# Altium schematic sheet FPGA.SchDoc: Cart
size Tabloid; ApprovedBy: NA; CompanyName: Cospan Design LLC; DrawnBy: David McCoy; Engineer: David McCoy; DocumentNumber: 12; Revision: A; SheetNumber: 12; SheetTotal: 18; Client: OSH; Project: Guppy Buddy; ProjectPrettyName: Guppy Buddy
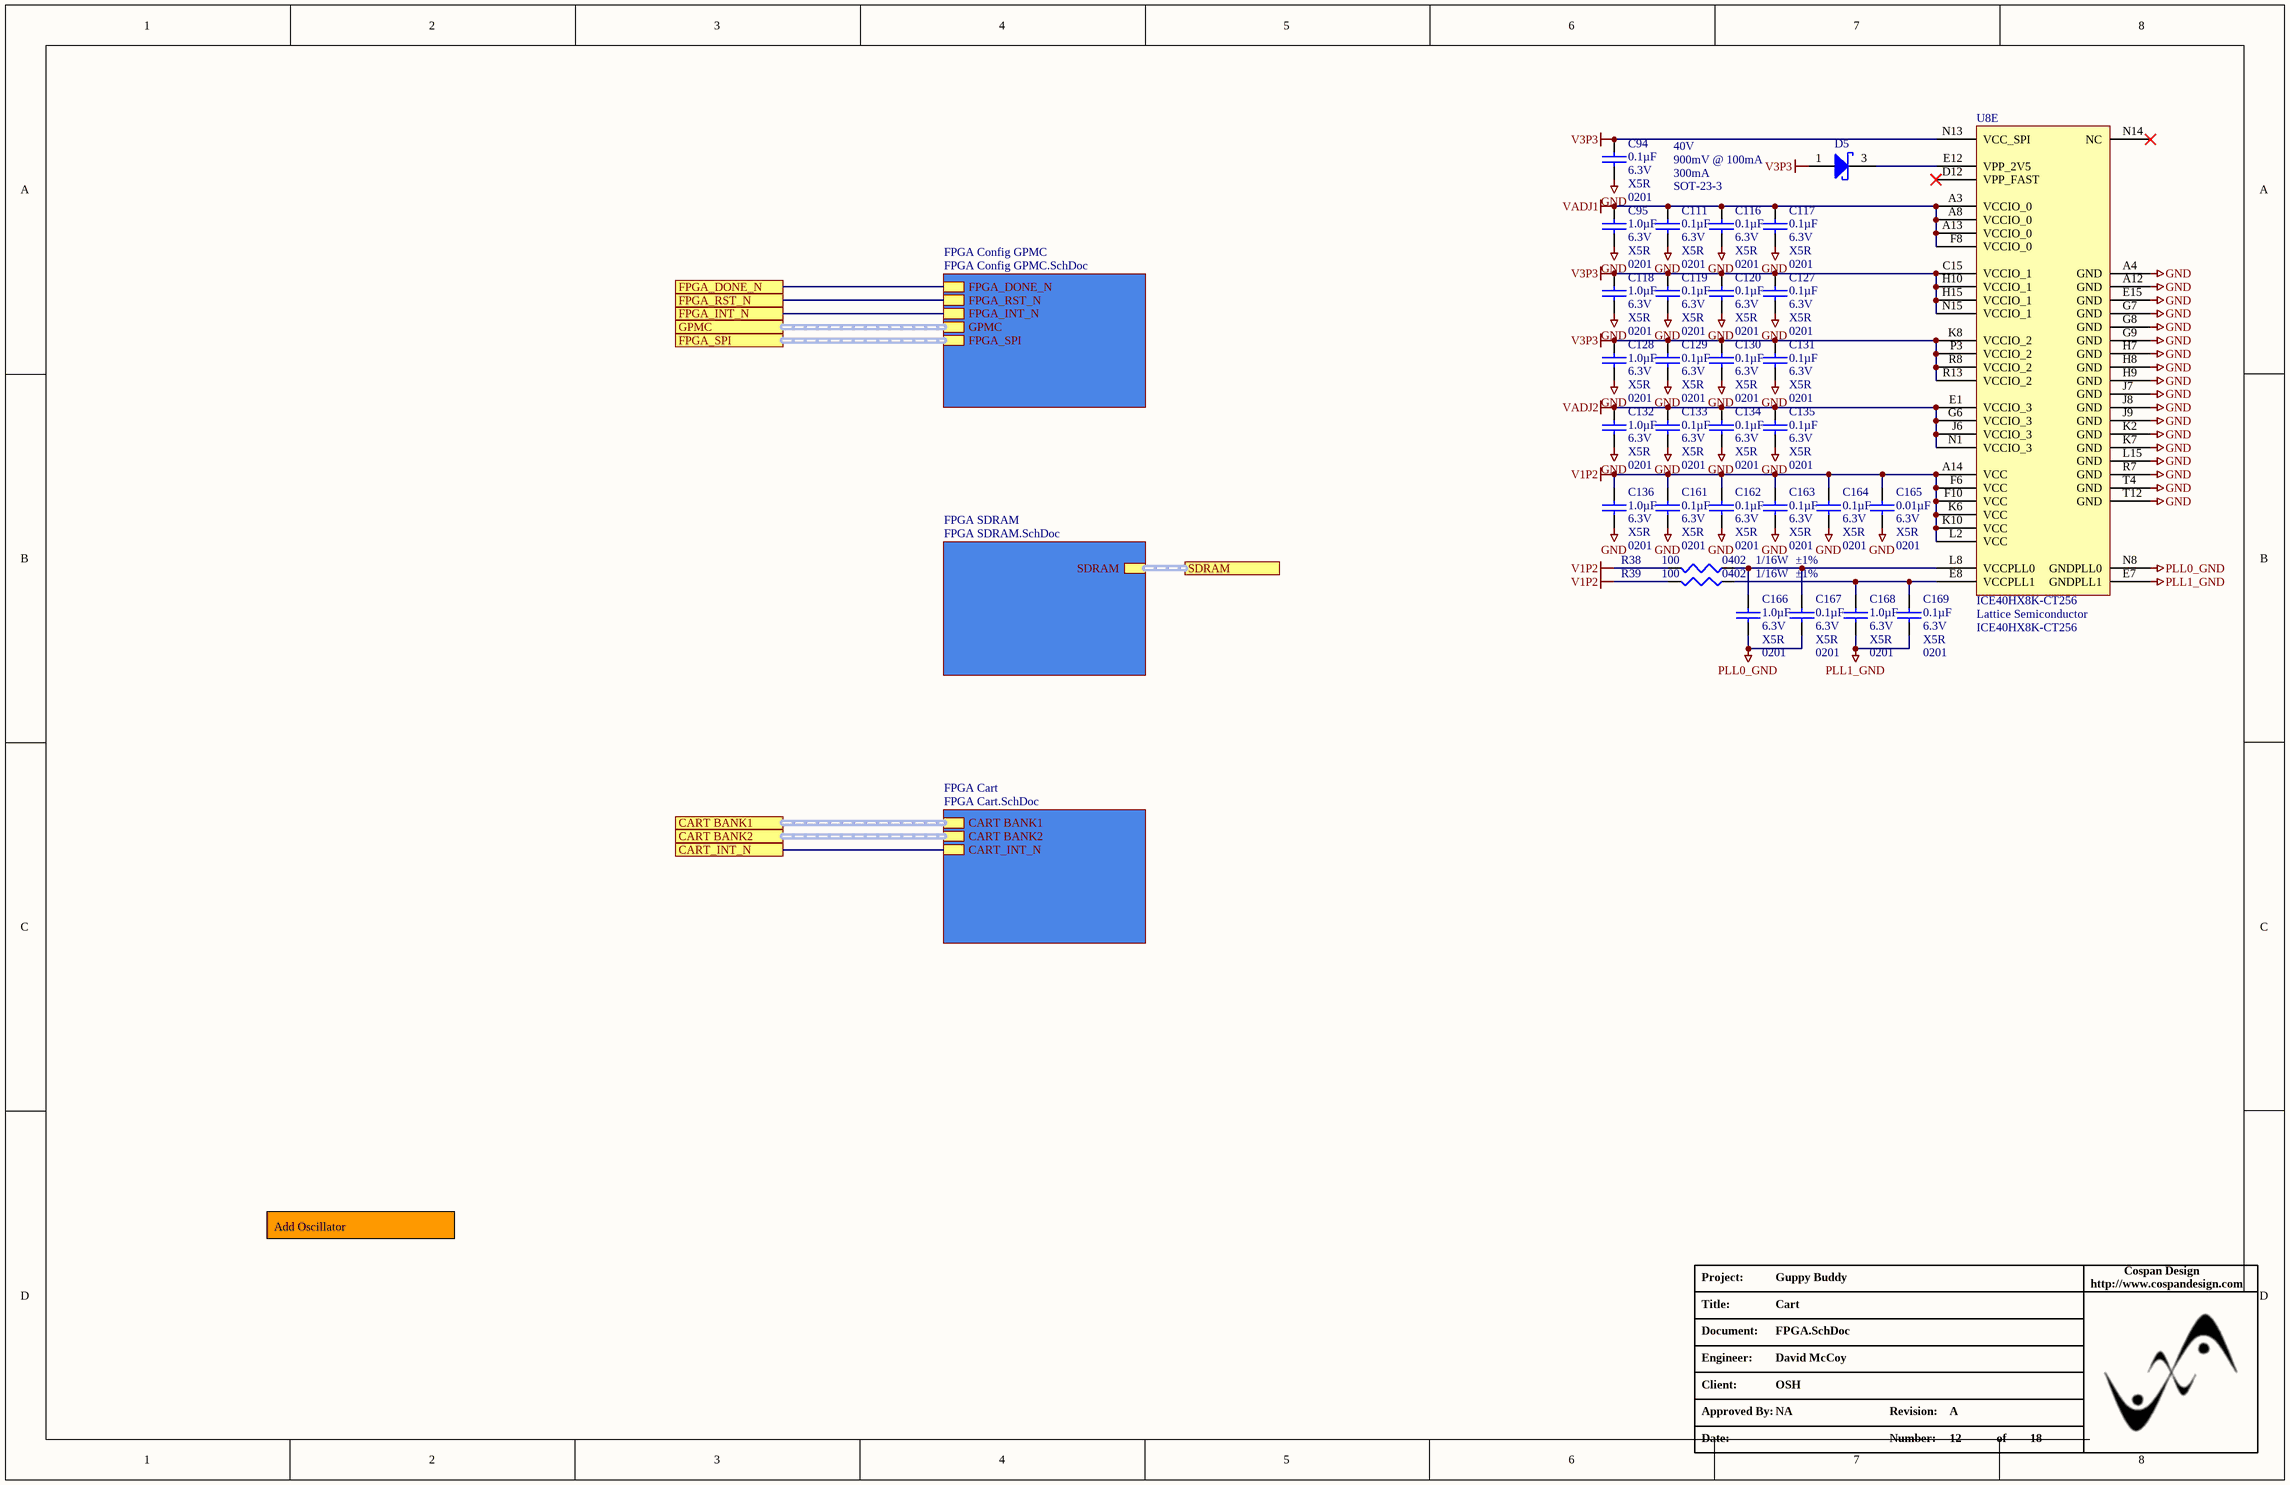
[diagram p0: FPGA.SchDoc]

## Parts
C94  Capacitance: 0.1µF  Voltage - Rated: 6.3V  Temperature Coefficient: X5R  Package / Case: 0201  [CAPC0201]  (hidden comment: 0.1UF)
C95  Capacitance: 1.0µF  Voltage - Rated: 6.3V  Temperature Coefficient: X5R  Package / Case: 0201  [CAPC0201]  (hidden comment: 1.0UF)
C111  Capacitance: 0.1µF  Voltage - Rated: 6.3V  Temperature Coefficient: X5R  Package / Case: 0201  [CAPC0201]  (hidden comment: 0.1UF)
C116  Capacitance: 0.1µF  Voltage - Rated: 6.3V  Temperature Coefficient: X5R  Package / Case: 0201  [CAPC0201]  (hidden comment: 0.1UF)
C117  Capacitance: 0.1µF  Voltage - Rated: 6.3V  Temperature Coefficient: X5R  Package / Case: 0201  [CAPC0201]  (hidden comment: 0.1UF)
C118  Capacitance: 1.0µF  Voltage - Rated: 6.3V  Temperature Coefficient: X5R  Package / Case: 0201  [CAPC0201]  (hidden comment: 1.0UF)
C119  Capacitance: 0.1µF  Voltage - Rated: 6.3V  Temperature Coefficient: X5R  Package / Case: 0201  [CAPC0201]  (hidden comment: 0.1UF)
C120  Capacitance: 0.1µF  Voltage - Rated: 6.3V  Temperature Coefficient: X5R  Package / Case: 0201  [CAPC0201]  (hidden comment: 0.1UF)
C127  Capacitance: 0.1µF  Voltage - Rated: 6.3V  Temperature Coefficient: X5R  Package / Case: 0201  [CAPC0201]  (hidden comment: 0.1UF)
C128  Capacitance: 1.0µF  Voltage - Rated: 6.3V  Temperature Coefficient: X5R  Package / Case: 0201  [CAPC0201]  (hidden comment: 1.0UF)
C129  Capacitance: 0.1µF  Voltage - Rated: 6.3V  Temperature Coefficient: X5R  Package / Case: 0201  [CAPC0201]  (hidden comment: 0.1UF)
C130  Capacitance: 0.1µF  Voltage - Rated: 6.3V  Temperature Coefficient: X5R  Package / Case: 0201  [CAPC0201]  (hidden comment: 0.1UF)
C131  Capacitance: 0.1µF  Voltage - Rated: 6.3V  Temperature Coefficient: X5R  Package / Case: 0201  [CAPC0201]  (hidden comment: 0.1UF)
C132  Capacitance: 1.0µF  Voltage - Rated: 6.3V  Temperature Coefficient: X5R  Package / Case: 0201  [CAPC0201]  (hidden comment: 1.0UF)
C133  Capacitance: 0.1µF  Voltage - Rated: 6.3V  Temperature Coefficient: X5R  Package / Case: 0201  [CAPC0201]  (hidden comment: 0.1UF)
C134  Capacitance: 0.1µF  Voltage - Rated: 6.3V  Temperature Coefficient: X5R  Package / Case: 0201  [CAPC0201]  (hidden comment: 0.1UF)
C135  Capacitance: 0.1µF  Voltage - Rated: 6.3V  Temperature Coefficient: X5R  Package / Case: 0201  [CAPC0201]  (hidden comment: 0.1UF)
C136  Capacitance: 1.0µF  Voltage - Rated: 6.3V  Temperature Coefficient: X5R  Package / Case: 0201  [CAPC0201]  (hidden comment: 1.0UF)
C161  Capacitance: 0.1µF  Voltage - Rated: 6.3V  Temperature Coefficient: X5R  Package / Case: 0201  [CAPC0201]  (hidden comment: 0.1UF)
C162  Capacitance: 0.1µF  Voltage - Rated: 6.3V  Temperature Coefficient: X5R  Package / Case: 0201  [CAPC0201]  (hidden comment: 0.1UF)
C163  Capacitance: 0.1µF  Voltage - Rated: 6.3V  Temperature Coefficient: X5R  Package / Case: 0201  [CAPC0201]  (hidden comment: 0.1UF)
C164  Capacitance: 0.1µF  Voltage - Rated: 6.3V  Temperature Coefficient: X5R  Package / Case: 0201  [CAPC0201]  (hidden comment: 0.1UF)
C165  Capacitance: 0.01µF  Voltage - Rated: 6.3V  Temperature Coefficient: X5R  Package / Case: 0201  [CAPC0201]  (hidden comment: 0.01UF)
C166  Capacitance: 1.0µF  Voltage - Rated: 6.3V  Temperature Coefficient: X5R  Package / Case: 0201  [CAPC0201]  (hidden comment: 1.0UF)
C167  Capacitance: 0.1µF  Voltage - Rated: 6.3V  Temperature Coefficient: X5R  Package / Case: 0201  [CAPC0201]  (hidden comment: 0.1UF)
C168  Capacitance: 1.0µF  Voltage - Rated: 6.3V  Temperature Coefficient: X5R  Package / Case: 0201  [CAPC0201]  (hidden comment: 1.0UF)
C169  Capacitance: 0.1µF  Voltage - Rated: 6.3V  Temperature Coefficient: X5R  Package / Case: 0201  [CAPC0201]  (hidden comment: 0.1UF)
D5  Voltage - DC Reverse (Vr) (Max): 40V  Voltage - Forward (Vf) (Max) @ If: 900mV @ 100mA  Current - Average Rectified (Io): 300mA  Package / Case: SOT-23-3  [SOT23]  (hidden comment: BAT54)
R38  Case: 0402  Resistance In Ohms: 100  Power (Watts): 1/16W  Tolerance: ±1%  [R_0402]  (hidden comment: R_0402_100.0)
R39  Case: 0402  Resistance In Ohms: 100  Power (Watts): 1/16W  Tolerance: ±1%  [R_0402]  (hidden comment: R_0402_100.0)
U8  ICE40HX8K-CT256  Manufacturer 1: Lattice Semiconductor  [LATC-caBGA-256]  (part E of 5)

## Sub-sheets
FPGA Cart = FPGA Cart.SchDoc: CART BANK2 (harness CART BANK2 Harness), CART_INT_N, CART BANK1 (harness CART BANK1 Harness)
FPGA Config GPMC = FPGA Config GPMC.SchDoc: FPGA_DONE_N, FPGA_RST_N, GPMC (harness GPMC Harness), FPGA_SPI (harness SPI Harness), FPGA_INT_N
FPGA SDRAM = FPGA SDRAM.SchDoc: SDRAM (harness SDRAM Harness)

## Ports
CART BANK1 (harness CART BANK1 Harness), CART BANK2 (harness CART BANK2 Harness), CART_INT_N, FPGA_DONE_N, FPGA_INT_N, FPGA_RST_N, FPGA_SPI (harness SPI Harness), GPMC (harness GPMC Harness), SDRAM (harness SDRAM Harness)

## Nets
GND: C94.1 C95.1 C111.1 C116.1 C117.1 C118.1 C119.1 C120.1 C127.1 C128.1 C129.1 C130.1 C131.1 C132.1 C133.1 C134.1 C135.1 C136.1 C161.1 C162.1 C163.1 C164.1 C165.1 U8.A4(GND) U8.A12(GND) U8.E15(GND) U8.G7(GND) U8.G8(GND) U8.G9(GND) U8.H7(GND) U8.H8(GND) U8.H9(GND) U8.J7(GND) U8.J8(GND) U8.J9(GND) U8.K2(GND) U8.K7(GND) U8.L15(GND) U8.R7(GND) U8.T4(GND) U8.T12(GND)
PLL0_GND: C166.1 C167.1 U8.N8(GNDPLL0)
PLL1_GND: C168.1 C169.1 U8.E7(GNDPLL1)
V1P2: C136.2 C161.2 C162.2 C163.2 C164.2 C165.2 R38.1 R39.1 U8.A14(VCC) U8.F6(VCC) U8.F10(VCC) U8.K6(VCC) U8.K10(VCC) U8.L2(VCC)
V3P3: C94.2 C118.2 C119.2 C120.2 C127.2 C128.2 C129.2 C130.2 C131.2 D5.1(A) U8.C15(VCCIO_1) U8.H10(VCCIO_1) U8.H15(VCCIO_1) U8.K8(VCCIO_2) U8.N13(VCC_SPI) U8.N15(VCCIO_1) U8.P3(VCCIO_2) U8.R8(VCCIO_2) U8.R13(VCCIO_2)
VADJ1: C95.2 C111.2 C116.2 C117.2 U8.A3(VCCIO_0) U8.A8(VCCIO_0) U8.A13(VCCIO_0) U8.F8(VCCIO_0)
VADJ2: C132.2 C133.2 C134.2 C135.2 U8.E1(VCCIO_3) U8.G6(VCCIO_3) U8.J6(VCCIO_3) U8.N1(VCCIO_3)
CART_INT_N: port CART_INT_N, sheet FPGA Cart/CART_INT_N
FPGA_DONE_N: port FPGA_DONE_N, sheet FPGA Config GPMC/FPGA_DONE_N
FPGA_INT_N: port FPGA_INT_N, sheet FPGA Config GPMC/FPGA_INT_N
FPGA_RST_N: port FPGA_RST_N, sheet FPGA Config GPMC/FPGA_RST_N
NetC166_2: C166.2 C167.2 R38.2 U8.L8(VCCPLL0)
NetC168_2: C168.2 C169.2 R39.2 U8.E8(VCCPLL1)
NetD5_3: D5.3(K) U8.E12(VPP_2V5)

Not connected (* = marked no-connect by the designer): U8 D12(VPP_FAST)* N14(NC)*

## Buses and harness runs
harness port CART BANK1 = sheet FPGA Cart/CART BANK1
harness port CART BANK2 = sheet FPGA Cart/CART BANK2
harness port FPGA_SPI = sheet FPGA Config GPMC/FPGA_SPI
harness port GPMC = sheet FPGA Config GPMC/GPMC
harness port SDRAM = sheet FPGA SDRAM/SDRAM

## Notes on the sheet
- Add Oscillator
- Project:
- http://www.cospandesign.com
- Cospan Design
- Document:
- Engineer:
- Title:
- Client:
- Approved By:
- Revision:
- Date:
- Number:
- of

## Library data of the parts
C94 C111 C116 C117 C119 C120 C127 C129-C131 C133-C135 C161-C164 C167 C169 = C_0201_0.1UF: CAP CER 0.1UF 6.3V 10% X5R 0201; Manufacturer: Murata Electronics North America; Manufacturer Part Number: GRM033R60J104KE19D; Supplier 1: Digi-Key; RoHS: RoHS Compliant; Category: Capacitors; Stock 1: 13375857; Pricing 1: 1=0.1, 10=0.033, 100=0.0149, 500=0.01062, 1000=0.00835, 2500=0.00759, 5000=0.00698 (USD); Packaging: Cut Tape (CT); Part Status: Active; Tolerance: ±10%; Operating Temperature: -55°C ~ 85°C; Features: -; Ratings: -; Applications: General Purpose; Mounting Type: Surface Mount, MLCC; Size / Dimension: 0.024" L x 0.012" W (0.60mm x 0.30mm); Height - Seated (Max): -; Thickness (Max): 0.013" (0.33mm); Lead Spacing: -; Lead Style: -; ComponentLink1URL: http://search.murata.co.jp/Ceramy/image/img/A01X/G101/ENG/GRM033R60J104KE19-01.pdf; ComponentLink1Description: http://search.murata.co.jp/Ceramy/image/img/A01X/G101/ENG/GRM033R60J104KE19-01.pdf; Supplier Part Number 1: 490-3167-1-ND
C95 C118 C128 C132 C136 C166 C168 = C_0201_1.0UF: CAP CER 1UF 6.3V 20% X5R 0201; Manufacturer: AVX; Manufacturer Part Number: 02016D105KAT2A; Tolerance: 10 %; Voltage Rating: 6.3 Volts; Product Status: New at Mouser; Supplier 1: Mouser; Supplier Part Number 1: 581-02016D105KAT2A; RoHS: RoHS Compliant; Category: Multilayer Ceramic Capacitors (MLCC) - SMD/SMT; Stock 1: 9875; Pricing: 1=0.878, 50=0.635, 100=0.394, 500=0.274, 1000=0.257, 15000=0.224 (AUD); Dimensions: 0.3 mm W x 0.6 mm L x 0.33 mm H; Operating Temperature Range: - 55 C to + 85 C; Packaging: Reel; Product: General Type MLCCs; Series: CX5R; Termination Style: SMD/SMT; Product Category: SMD Ceramic Capacitors; Temperature Coefficient / Code: X5R; RoHS - Mouser: Y; Minimum Order Quantity: 1; Reeling: True; ComponentLink1URL: http://www.avx.com/docs/Catalogs/cx5r.pdf; ComponentLink1Description: http://www.avx.com/docs/Catalogs/cx5r.pdf
C165 = C_0201_0.01UF: CAP CER 10000PF 6.3V X5R 0201; Manufacturer: TDK Corporation; Manufacturer Part Number: C0603X5R0J103M; Tolerance: ±20%; Supplier 1: Digi-Key; Supplier Part Number 1: 445-4704-1-ND; RoHS: RoHS Compliant; Category: Capacitors; Stock 1: 31876; Pricing: 1=0.08, 10=0.05, 100=0.018, 250=0.013, 500=0.0096, 1000=0.0065 (USD); Mounting Type: Surface Mount, MLCC; Operating Temperature: -55°C ~ 85°C; Applications: General Purpose; Ratings: -; Size / Dimension: 0.024" L x 0.012" W (0.60mm x 0.30mm); Height - Seated (Max): -; Thickness (Max): 0.013" (0.33mm); Lead Spacing: -; Features: -; Packaging: Cut Tape (CT); Lead Style: -; ComponentLink1URL: http://www.tdk.com/pdf/general_B11.pdf; ComponentLink1Description: http://www.tdk.com/pdf/general_B11.pdf
D5 = D_SCHOTT_BAT54WFILM: DIODE SCHOTTKY 40V 300MA SOT-23; Manufacturer 1: STMicroelectronics; Description 1: DIODE SCHOTTKY 40V 300MA SOT323; Forward Voltage: 900mV; Max Surge Current: 1A; Recovery Time: 5ns; Peak Reverse Current: 1uA; Element Configuration: Single; Polarity: Standard; Voltage Rating (DC): 30V; Capacitance: 10pF; ComponentLink1URL: http://www.fairchildsemi.com/ds/BA/BAT54.pdf; ComponentLink1Description: http://www.fairchildsemi.com/ds/BA/BAT54.pdf; Supplier 1: Digi-Key; Supplier Part Number 1: 497-2530-6-ND; Stock 1: 16371; Pricing 1: 1=0.38, 10=0.286, 100=0.1617, 500=0.10706, 1000=0.08209 (USD); Mount: Surface Mount; Case/Package: SOT-323; Number of Pins: 3; Min Operating Temperature: -40°C; Max Operating Temperature: 150°C; Package Quantity: 1; Packaging: Tape and Reel; Forward Current: 300mA; Max Reverse Leakage Current: 1uA; Average Rectified Current: 300mA; Reverse Recovery Time: 5ns; Max Repetitive Reverse Voltage (Vrrm): 40V; Peak Non-Repetitive Surge Current: 1A; Max Forward Surge Current (Ifsm): 1A; Current Rating: 300mA; Output Current: 300mA; Max Reverse Voltage (DC): 40V; Length: 2mm; Height: 1.1mm; Width: 1.25mm; Radiation Hardening: No; Lead Free: Lead Free; ComponentLink2URL: https://datasheet.ciiva.com/4714/cd00001322-105648-4714481.pdf; ComponentLink2Description: https://datasheet.ciiva.com/4714/cd00001322-105648-4714481.pdf; ComponentLink3URL: https://datasheet.ciiva.com/15144/getdatasheetpartid-39206-15144069.pdf; ComponentLink3Description: https://datasheet.ciiva.com/15144/getdatasheetpartid-39206-15144069.pdf; ComponentLink4URL: https://datasheet.ciiva.com/915/cd00001322-915500.pdf; ComponentLink4Description: https://datasheet.ciiva.com/915/cd00001322-915500.pdf; ComponentLink5URL: https://datasheet.ciiva.com/915/cd00001322-915501.pdf; ComponentLink5Description: https://datasheet.ciiva.com/915/cd00001322-915501.pdf; ComponentLink6URL: https://datasheet.ciiva.com/915/cd00001322-915502.pdf; ComponentLink6Description: https://datasheet.ciiva.com/915/cd00001322-915502.pdf; Manufacturer Part Number 1: BAT54WFILM
R38 R39 = R_0402_100.0: RES 100 OHM 1/16W 1% 0402 SMD; Manufacturer: Yageo; Manufacturer Part Number: RC0402FR-07100RL; Temperature Coefficient: ±100ppm/°C; Supplier 1: Digi-Key; RoHS: RoHS Compliant; Category: Resistors; Stock 1: 2051645; Pricing 1: 1=0.1, 10=0.013, 25=0.0096, 100=0.0054, 250=0.00412, 500=0.00328, 1000=0.00242, 2500=0.0021, 5000=0.00173 (USD); Packaging: Cut Tape (CT); Resistance (Ohms): 100; Composition: Thick Film; Features: Moisture Resistant; Operating Temperature: -55°C ~ 155°C; Package / Case: 0402 (1005 Metric); Supplier Device Package: 0402; Size / Dimension: 0.039" L x 0.020" W (1.00mm x 0.50mm); Height: 0.016" (0.40mm); Number of Terminations: 2; ComponentLink1URL: http://www.yageo.com/documents/recent/PYu-RC_Group_51_RoHS_L_2.pdf; ComponentLink1Description: http://www.yageo.com/documents/recent/PYu-RC_Group_51_RoHS_L_2.pdf; Supplier Part Number 1: 311-100LRCT-ND
U8 = U_ICE40HX8K-CT256: iCE40 HX8K Series FPGA Family, 7680 Logic Cells, 1.2 V Core, 128 K Embedded RAM Bits, 256-ball caBGA, Pb-Free, Tray; Supply Voltage: 1.2V; Phase-Locked Loops: 2; Logic Cells: 7680; Embedded RAM Bits: 128K; Description 1: IC FPGA HX 7680LUTS 1.2V 256BGA; Density: 128Kb; Number of Logic Blocks (LABs): 960; Number of I/Os: 206; Min Supply Voltage: 1.14V; Max Supply Voltage: 1.26V; RAM Size: 131072b; Max Frequency: 533MHz; PackageReference: caBGA-256; PackageDescription: 256-Ball Chip Array Ball Grid Array, Body 14 x 14 mm, Pitch 0.8 mm; RoHS: TRUE; Packing: Tray; Mounting Technology: Surface Mount; ComponentLink3URL: http://www.latticesemi.com/lit/docs/package/pkg.pdf; ComponentLink1Description: Manufacturer URL; ComponentLink3Description: Package Specification; Code_JEDEC: MO-275; PackageVersion: Rev. 03.9, 02/2013; ComponentLink1URL: http://www.latticesemi.com/en; ComponentLink2URL: http://www.latticesemi.com/~/media/Documents/DataSheets/iCE/iCE40LPHXFamilyDataSheet.pdf; PartNumber: ICE40HX8K-CT256; Manufacturer: Lattice Semiconductor; ComponentLink2Description: Datasheet; DatasheetVersion: Rev. 02.9; Supplier 1: Digi-Key; Supplier Part Number 1: 220-1575-ND; Stock 1: 549; Pricing 1: 1=11.41, 25=9.898, 100=9.4536 (USD); Case/Package: BGA; Number of Pins: 256; Weight: 0.098203oz; Min Operating Temperature: -40°C; Max Operating Temperature: 85°C; Package Quantity: 119; Packaging: Tray; Operating Supply Voltage: 1.2V; Number of Gates: 7680; Number of Logic Elements/Cells: 7680; Memory Size: 128Kb; Number of Registers: 7680; Length: 14mm; Height: 17mm; Width: 14mm; Lead Free: Lead Free; ComponentLink4URL: http://www.mouser.com/ds/2/225/iCE40FamilyHandbook-311139.pdf; ComponentLink4Description: http://www.mouser.com/ds/2/225/iCE40FamilyHandbook-311139.pdf; Manufacturer Part Number 1: ICE40HX8K-CT256